# Altium schematic sheet crypto_blk.SchDoc
size A4; Engineer: JBayalas; DocumentNumber: 5; Revision: V1.1; SheetNumber: 5; SheetTotal: 13
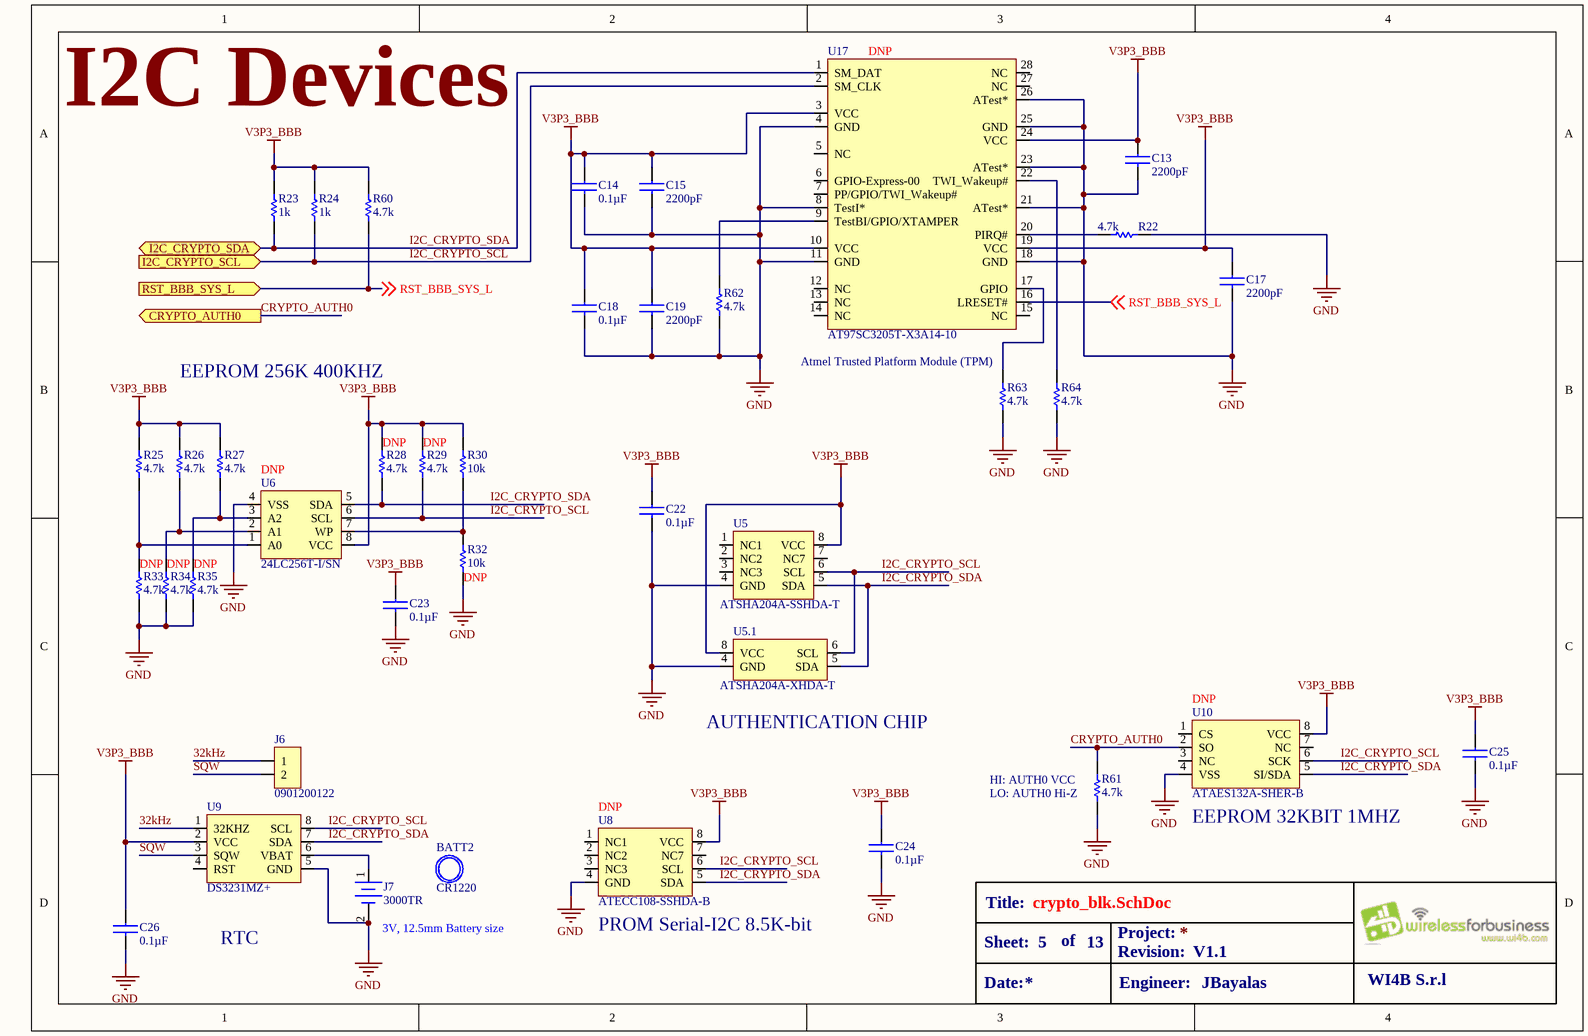
[diagram p0: crypto_blk.SchDoc]

## Parts
BATT2  CR1220
C13  value 2200pF  [C0805]  (hidden comment: *)
C14  value 0.1µF  [C0402]  (hidden comment: *)
C15  value 2200pF  [C0805]  (hidden comment: *)
C17  value 2200pF  [C0603]  (hidden comment: *)
C18  value 0.1µF  [C0402]  (hidden comment: *)
C19  value 2200pF  [C0805]  (hidden comment: *)
C22  value 0.1µF  [C0402]  (hidden comment: *)
C23  value 0.1µF  [C0402]  (hidden comment: *)
C24  value 0.1µF  [C0402]  (hidden comment: *)
C25  value 0.1µF  [C0402]  (hidden comment: *)
C26  value 0.1µF  [C0402]  (hidden comment: *)
J6  *  [0901200122]  (value not drawn)
J7  3000TR  [3000TR]
R22  value 4.7k  [R0402]  (hidden comment: RC0402JR-074K7L)
R23  value 1k  [R0402]  (hidden comment: *)
R24  value 1k  [R0402]  (hidden comment: *)
R25  value 4.7k  [R0402]  (hidden comment: *)
R26  value 4.7k  [R0402]  (hidden comment: *)
R27  value 4.7k  [R0402]  (hidden comment: *)
R28  value 4.7k  LOAD: DNP  [R0402]  (hidden comment: *)
R29  value 4.7k  LOAD: DNP  [R0402]  (hidden comment: *)
R30  value 10k  [R0402]  (hidden comment: *)
R32  value 10k  LOAD: DNP  [R0402]  (hidden comment: *)
R33  value 4.7k  LOAD: DNP  [R0402]  (hidden comment: *)
R34  value 4.7k  LOAD: DNP  [R0402]  (hidden comment: *)
R35  value 4.7k  LOAD: DNP  [R0402]  (hidden comment: *)
R60  value 4.7k  [R0402]  (hidden comment: *)
R61  value 4.7k  [R0402]  (hidden comment: *)
R62  value 4.7k  [R0402]  (hidden comment: RC0402JR-074K7L)
R63  value 4.7k  [R0402]  (hidden comment: RC0402JR-074K7L)
R64  value 4.7k  [R0402]  (hidden comment: RC0402JR-074K7L)
U5  value ATSHA204A-SSHDA-T  [SOIC-8]  (hidden comment: *)
U5.1  ATSHA204A-XHDA-T  [TSSOP-8 (wide Body)]
U6  value 24LC256T-I/SN  LOAD: DNP  [SOIC-8]  (hidden comment: *)
U8  value ATECC108-SSHDA-B  LOAD: DNP  [SOIC-8]  (hidden comment: *)
U9  value DS3231MZ+  [SOIC-8]  (hidden comment: *)
U10  LOAD: DNP  [SOIC-8]  (hidden comment: ATAES132A-SHER-B)
U17  LOAD: DNP  [TSSOP-28]  (hidden comment: AT97SC3205T-X3A14-10)

## Ports
CRYPTO_AUTH0 (out), I2C_CRYPTO_SCL (in), I2C_CRYPTO_SDA (bidir), RST_BBB_SYS_L (in)

## Nets
GND: C13.2 C14.2 C15.2 C17.2 C18.2 C19.2 C22.2 C23.2 C24.2 C25.2 C26.2 J7.2(-) R22.1 R32.1 R33.1 R34.1 R35.1 R61.1 R62.1 R63.1 R64.1 U5.4(GND) U5.1.4(GND) U6.4(VSS) U8.4(GND) U9.5(GND) U10.4(VSS) U17.4(GND) U17.8(TestI*) U17.11(GND) U17.18(GND) U17.21(ATest*) U17.23(ATest*) U17.25(GND) U17.26(ATest*)
V3P3_BBB: C13.1 C14.1 C15.1 C17.1 C18.1 C19.1 C22.1 C23.1 C24.1 C25.1 C26.1 R23.1 R24.1 R25.2 R26.2 R27.2 R28.2 R29.2 R30.2 R60.2 U5.8(VCC) U5.1.8(VCC) U6.8(VCC) U8.8(VCC) U9.2(VCC) U10.8(VCC) U17.3(VCC) U17.10(VCC) U17.19(VCC) U17.24(VCC)
32kHz: J6.1 U9.1(32KHZ)
CRYPTO_AUTH0: R61.2 U10.2(SO) ; port CRYPTO_AUTH0
I2C_CRYPTO_SCL: R24.2 R29.1 U5.6(SCL) U5.1.6(SCL) U6.6(SCL) U8.6(SCL) U9.8(SCL) U10.6(SCK) U17.2(SM_CLK) ; port I2C_CRYPTO_SCL
I2C_CRYPTO_SDA: R23.2 R28.1 U5.5(SDA) U5.1.5(SDA) U6.5(SDA) U8.5(SDA) U9.7(SDA) U10.5(SI/SDA) U17.1(SM_DAT) ; port I2C_CRYPTO_SDA
RST_BBB_SYS_L: R60.1 U17.16(LRESET#) ; off-sheet RST_BBB_SYS_L, port RST_BBB_SYS_L
SQW: J6.2 U9.3(SQW)
NetJ7_1: J7.1(+) U9.6(VBAT)
NetR22_2: R22.2 U17.20(PIRQ#)
NetR25_1: R25.1 R33.2 U6.1(A0)
NetR26_1: R26.1 R34.2 U6.2(A1)
NetR27_1: R27.1 R35.2 U6.3(A2)
NetR30_1: R30.1 R32.2 U6.7(WP)
NetR62_2: R62.2 U17.9(TestBI/GPIO/XTAMPER)
NetR63_2: R63.2 U17.17(GPIO)
NetR64_2: R64.2 U17.22(TWI_Wakeup#)

Not connected (* = marked no-connect by the designer): U5 1(NC1) 2(NC2) 3(NC3) 7(NC7); U8 1(NC1) 2(NC2) 3(NC3) 7(NC7); U9 4(RST); U10 1(CS) 3(NC) 7(NC); U17 5(NC) 6(GPIO-Express-00) 7(PP/GPIO/TWI_Wakeup#) 12(NC) 13(NC) 14(NC) 15(NC) 27(NC) 28(NC)

## Notes on the sheet
- I2C Devices
- EEPROM 256K 400KHZ
- (near R63) Atmel Trusted Platform Module (TPM)
- (near U5.1) AUTHENTICATION CHIP
- (near R61) HI: AUTH0 VCC
- (near R61) LO: AUTH0 Hi-Z
- (near U10) EEPROM 32KBIT 1MHZ
- RTC
- (near J7) 3V, 12.5mm Battery size
- (near U8) PROM Serial-I2C 8.5K-bit
- Title:
- Sheet:
- Date:
- of
- Project:
- Revision:
- Engineer:
- WI4B S.r.l

## Library data of the parts
BATT2 = CR1220: Coin Cell Battery 35mAh 12.5mm; MFT: FDK; RATING: 3V, 35mAh; FUNCTION: CRYPTO; TYPE: SMD; LOAD: *; VALUE: CR1220; MPN: CR1220
C13 C15 C19 = 08055C222KAT2A: CAP CER 2200PF 50V 10% X7R 0805; MFT: AVX Corporation; TYPE: Surface Mount, MLCC; FUNCTION: CRYPTO; MPN: 08055C222KAT2A; RATING: 50V 10% X7R
C14 C18 C22-C26 = CL05B104KO3LNNC: CAP CER 0.1UF 16V X7R 0402; MFT: Samsung Electro-Mechanics America, Inc.; RATING: ±10%, 16V; TYPE: Surface Mount, MLCC; FUNCTION: CRYPTO; MPN: CL05B104KO3LNNC
C17 = C0603C222K5RACTU: CAP CER 2200PF 50V X7R 0603; MFT: KEMET; TYPE: SMD; FUNCTION: CRYPTO; MPN: C0603C222K5RACTU; LOAD: *; RATING: 50V
J6 = 0901200122: CONN HEADER 2POS .100" STR TIN; MFT: Molex, LLC; FUNCTION: CRYPTO; TYPE: Through Hole; VALUE: 0901200122; MPN: 0901200122
J7 = 3000TR: Coin Cell Battery Holders SM COIN CELL B/H; MFT: Keystone Electronics; FUNCTION: CRYPTO; MPN: 3000TR; TYPE: SMD; RATING: *; LOAD: *; VALUE: 3000TR
R22 R25-R29 R33-R35 R60-R64 = RC0402JR-074K7L: RES SMD 4.7K OHM 5% 1/16W 0402; MFT: Yageo; FUNCTION: CRYPTO; MPN: RC0402JR-074K7L; RATING: ±5%; TYPE: Surface Mount
R23 R24 = MCS04020C1001FE000: RES SMD 1K OHM 1% 1/10W 0402; MFT: Vishay Beyschlag; FUNCTION: CRYPTO; MPN: MCS04020C1001FE000; TYPE: SMD; RATING: 1/10W; LOAD: *
R30 R32 = CRCW040210K0FKEDHP: RES SMD 10K OHM 1% 1/5W 0402; MFT: Vishay Dale; RATING: 0.2W, 1/5W; FUNCTION: CRYPTO; MPN: CRCW040210K0FKEDHP; TYPE: Surface Mount
U5 = ATSHA204A-SSHDA-T: IC AUTHENTICATION CHIP 8SOIC; MFT: Microchip Technology; FUNCTION: CRYPTO; MPN: ATSHA204A-SSHDA-T; LOAD: *; RATING: *; TYPE: SMD
U5.1 = ATSHA204A-XHDA-T: IC CRYPTO 4.5KB I2C; MFT: Microchip Technology; LOAD: *; TYPE: SMD; VALUE: ATSHA204A-XHDA-T; RATING: *; MPN: ATSHA204A-XHDA-T
U6 = 24LC256T-I/SN: IC EEPROM 256K I2C 400KHZ 8SOIC; MFT: Microchip Technology; FUNCTION: CRYPTO; RATING: *; TYPE: SMD; MPN: 24LC256T-I/SN
U8 = ATECC108-SSHDA-B: EEPROM Serial-I2C 8.5K-bit 2.5V/3.3V/5V 8-Pin SOIC Bulk; MFT: Microchip / Atmel; FUNCTION: CRYPTO; MPN: ATECC108-SSHDA-B; TYPE: SMD; RATING: 2.5V/3.3V/5V
U9 = DS3231MZ+: IC RTC I2C 8SOIC; MFT: Maxim; FUNCTION: CRYPTO; MPN: DS3231MZ+; TYPE: SMD; RATING: *; LOAD: *
U10 = ATAES132A-SHER-B: IC EEPROM 32KBIT 1MHZ 8SOIC; MFT: Microchip; FUNCTION: CRYPTO; MPN: ATAES132A-SHER-B; RATING: *; TYPE: SMD; VALUE: ATAES132A-SHER-B
U17 = AT97SC3205T-X3A14-10: STD COM 12C TPM 4.4 MM TSSOP UEK; MFT: Microchip / Atmel; FUNCTION: CRYPTO; MPN: AT97SC3205T-X3A14-10; TYPE: SMD; RATING: *; VALUE: AT97SC3205T-X3A14-10